# Altium schematic sheet Motor_Controller.SchDoc
size A
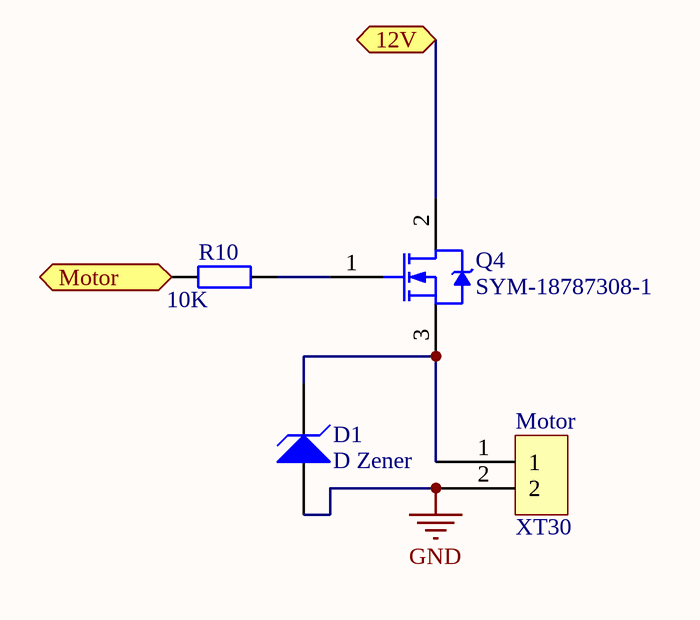
[diagram p0: Motor_Controller.SchDoc]

## Parts
D1  D Zener  [PCB-l9es7xv56lx35n1ll0aq-1]
Motor  XT30  [PCB-8h6goupi0sbkduz6cbnu-1]
Q4  SYM-18787308-1  [PCB-18787308-1]
R10  Ohms: 10K  [PCB-mctr3h3tvednl0z90ud0-1]  (hidden comment: Res2)

## Ports
12V, Motor

## Nets
GND: D1.1(A) Motor.2
12V: Q4.2(D) ; port 12V
Motor: R10.1 ; port Motor
NetD1_2: D1.2(K) Motor.1 Q4.3(S)
NetQ4_1: Q4.1(G) R10.2

## Library data of the parts
D1 = CMP-88cd428957ea570a-1: 1N4745A Series 1.3 W 16 V 200 mA 5 % Tolerance Through Hole Zener Diode - DO-41; Manufacturer Part Number: 1N4745A-TR; Power Rating: 1.00 W; Number of Pins: 2; Octopart URL: http://octopart.com/1n4745a-tr-vishay-55507521; OctopartID: 88cd428957ea570a; Case/Package: DO-41; RoHS: Compliant; Lifecycle Status: Active
Motor = CMP-nlx8yci0umf6n9sk0ty3-1: Very similar to the XT60 models, but smaller and made for 30A; Homepage URL: https://www.amazon.com/ProgressiveRC-AC-XT30-XT30-Connectors-pairs/dp/B011WDZGM0; CustomComponentID: nlx8yci0umf6n9sk0ty3
Q4 = CMP-18787308-5: MS; Part Family: IRFZ44N; Breakdown Voltage (Drain to Source): 55.0 V; Current Rating: 49.0 A; Rise Time: 60.0 ns; Gate Charge: 63.0 nC; Drain to Source Resistance (on) (Rds): 17.5 mΩ; Power Dissipation: 83.0 W; Input Capacitance: 1.47 nF; Lead-Free Status: Lead Free; Lifecycle Status: Active; Mounting Style: Through Hole; Octopart URL: http://octopart.com/irfz44npbf-international+rectifier-7371454; Continuous Drain Current (Ids): 49.0 A; OctopartID: 444b8d311b939b8c; Number of Pins: 3; Voltage Rating (DC): 55.0 V; REACH SVHC Compliance: No SVHC
R10 = CMP-1413dd18cda2cbd4-1: Resistor; Carbon Composition; Res 3.9 Kilohms; Pwr-Rtg 0.25 W; Tol 5%; Axial; Manufacturer Part Number: OD392JE; Power Rating: 250 mW; Lead-Free Status: Lead Free; Mounting Style: Through Hole, Axial; OctopartID: 1413dd18cda2cbd4; Resistance Tolerance: ±5%; Size-Diameter: 2.50 mm